# EAGLE design Audio Alarm Monitoring Pi Hat (EAGLE 7.7.0)
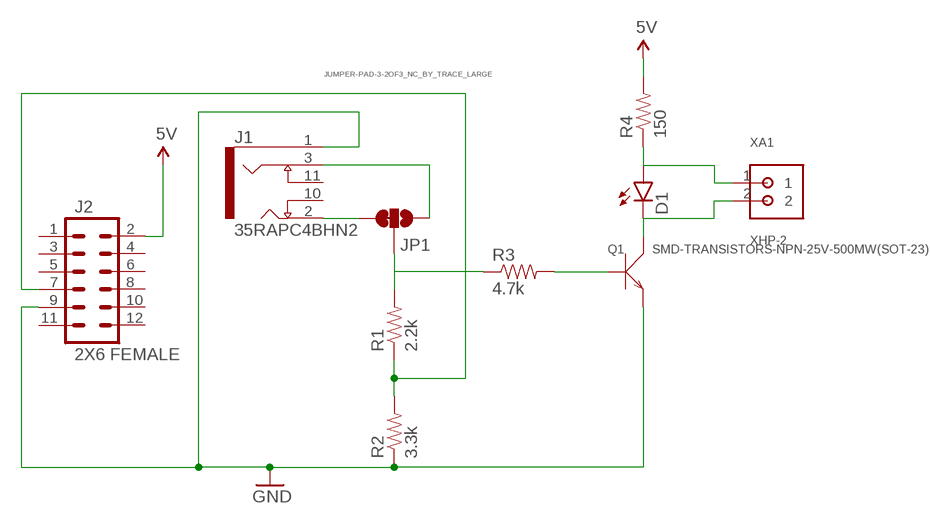
[diagram p0: schematic, sheet 1]

## Parts
D1  LED1206  [LED-1206]
J1  35RAPC4BHN2  [SWITCHCRAFT_35RAPC4BHN2]
J2  2X6 FEMALE  M06X2PTH_FEMALE  [2X6]
JP1  JUMPER-PAD-3-2OF3_NC_BY_TRACE_LARGE  [PAD-JUMPER-3-2OF3_NC_BY_TRACE_YES_SILK_LARGE]
Q1  SMD-TRANSISTORS-NPN-25V-500MW(SOT-23)  [SOT-23]
R1  2.2k  RESISTOR1206  [1206]
R2  3.3k  RESISTOR1206  [1206]
R3  4.7k  RESISTOR1206  [1206]
R4  150  RESISTOR1206  [1206]
XA1  XHP-2  [JST_XHP-2]

## Nets
5V: J2.2 R4.2
GND: J1.1 J2.9 Q1.2(E) R2.1
N$1: J2.7 R1.1 R2.2
N$2: JP1.2 R1.2 R3.1
N$4: J1.2 JP1.3
N$5: D1.C Q1.3(C) XA1.2
N$6: J1.3 JP1.1
N$8: D1.A R4.1 XA1.1
N$9: Q1.1(B) R3.2
Unconnected: J1.10 J1.11 J2.1 J2.3 J2.4 J2.5 J2.6 J2.8 J2.10 J2.11 J2.12

## Library data of the parts
D1 = SparkFun-LED:LED: LEDs Standard schematic elements and footprints for 5mm, 3mm, 1206, and 0603 sized LEDs. 5mm - Spark Fun Electronics SKU : COM-00529 (and others)
J1 = 35RAPC4BHN2:35RAPC4BHN2: Conn 3.5MM Stereo Jack F 5 POS Solder RA Thru-Hole 5 Terminal 1 Port; AVAILABILITY: Unavailable; DESCRIPTION: 3.50mm _0.141, 1/8, Mini Plug_ - Headphone Phone Jack Stereo _3 Conductor, TRS_ Connector Solder; MF: Switchcraft; MP: 35RAPC4BHN2; PACKAGE: None; PRICE: None
J2 = SparkFun-Connectors:M06X2; PROD_ID: CONN-12423
JP1 = SparkFun-Passives:JUMPER-PAD-3-2OF3_NC_BY_TRACE
Q1 = SMD-TRANSISTORS-NPN-25V-500MW_SOT-23_:SMD-TRANSISTORS-NPN-25V-500MW(SOT-23): 305010017; AVAILABILITY: Unavailable; DESCRIPTION: Bipolar _BJT_ Transistor NPN 25V 1.5A 100MHz 625mW Surface Mount SOT-23; MF: Recom Power; MP: S8050; PACKAGE: SOT-23 Micro Commercial; PRICE: None
R1-R4 = SparkFun-Passives:RESISTOR: Resistor Basic schematic elements and footprints for 0603, 1206, and PTH resistors.
XA1 = XHP-2:XHP-2: XH Series 2 Position 2.5 mm Pitch Wire-to-Board Housing Connector; AVAILABILITY: Unavailable; DESCRIPTION: 20 Rectangular Connectors - Housings Receptacle Natural 0.098 _2.50mm_; MF: JST Sales; MP: XHP-2; PACKAGE: None; PRICE: None

## Board
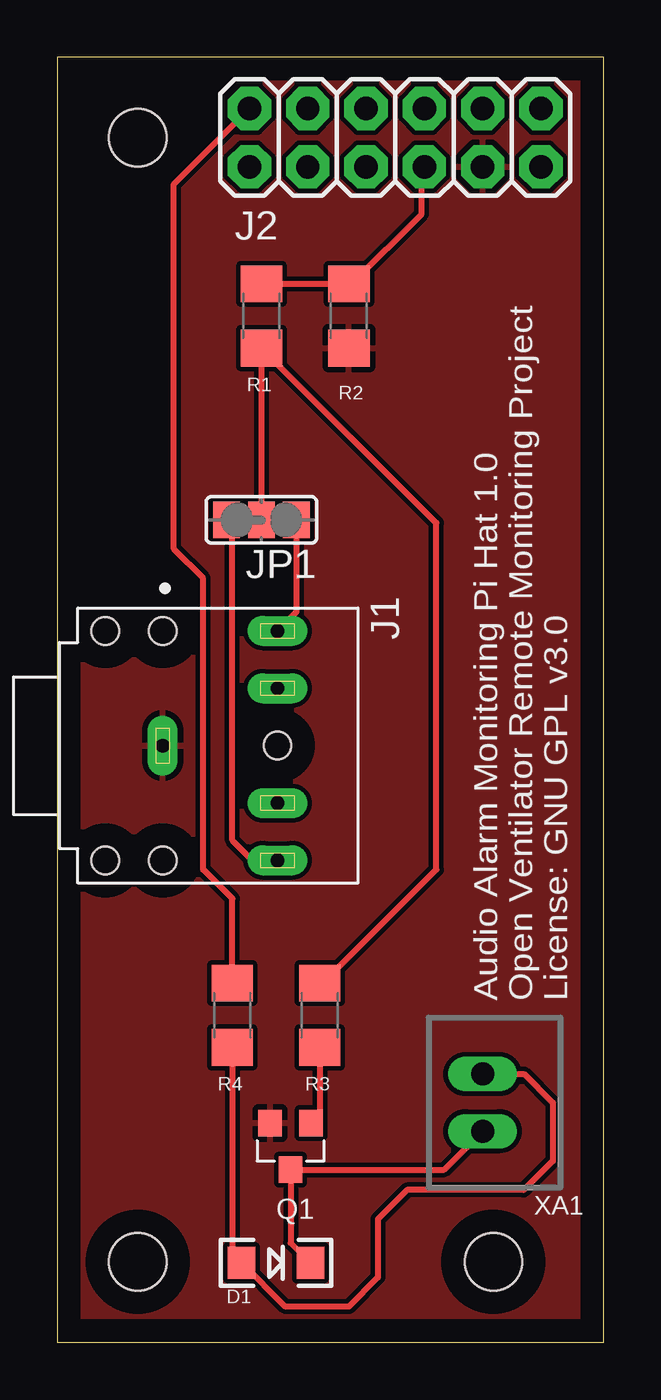
[diagram p1: board, top side]
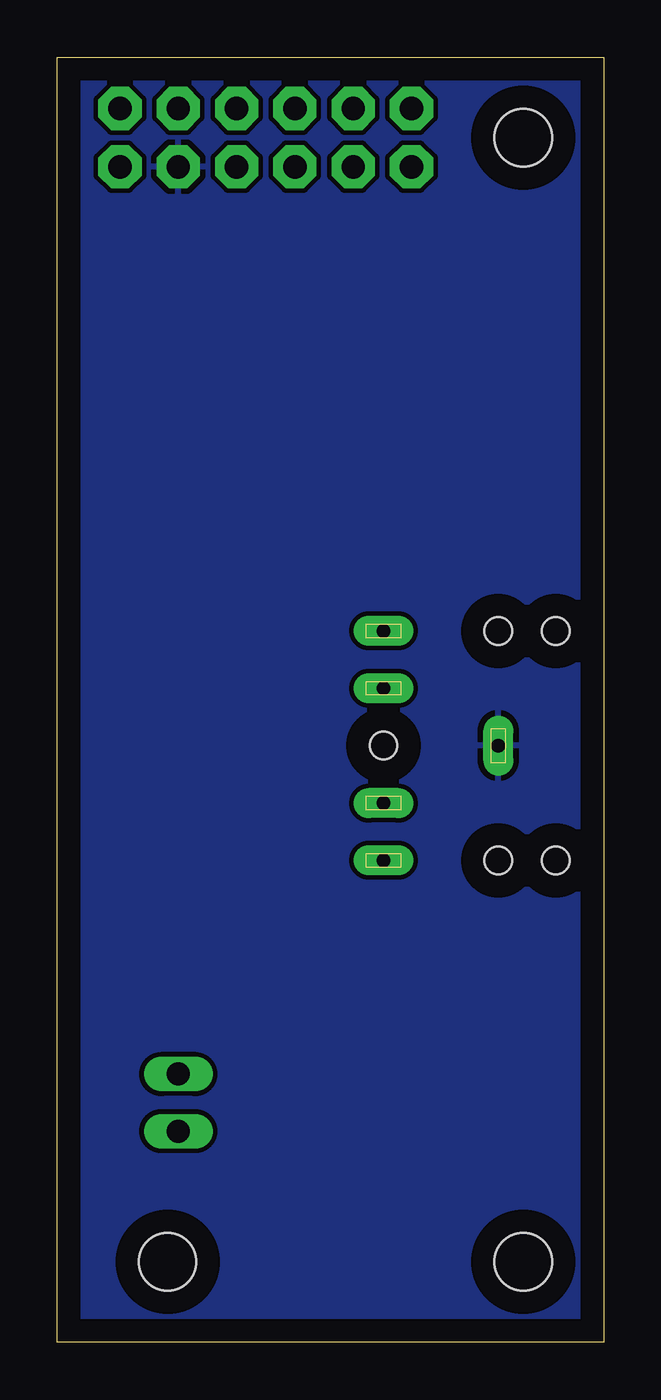
[diagram p2: board, bottom side, seen from below]

Size 23.8 x 56 mm. Coordinates in mm from the lower left corner, seen from the top.
Outline: 0,0 23.8,0 23.8,56 0,56 0,0
Copper layers (1*16): Top 0.035mm / dielectric 1.5mm / Bottom 0.035mm
Design rules "default *": minimum track width 7mil, minimum drill 10mil, track to track 8mil, track to pad 8mil, pad to pad 8mil, via to via 8mil, smd to smd 8mil, copper to edge 40mil, drill to drill 8mil, minimum pad ring 10mil, minimum via ring 8mil, stop-mask expansion 4mil, vias tented up to drill 0mil, thermal gap 10mil
Holes 2.5 mm at 3.5,52.5 3.5,3.5 19,3.5

### Footprints (pad centres in the part's own frame; a part is rotated, then mirrored left to right if it is on the bottom)
LED-1206 = smd 1.2 x 1.4: A -1.5,0; C 1.5,0
SWITCHCRAFT_35RAPC4BHN2 = drill 0.6 pad 1.3 long: 1 0,-1; 2 5,4; 3 -5,4; 10 2.5,4; 11 -2.5,4 | hole 1.2: 0,4; -5,-1; -5,-3.5; 5,-1; 5,-3.5
2X6 = drill 1.016 pad 1.88 octagon: 1 0,0; 2 0,2.54; 3 2.54,0; 4 2.54,2.54; 5 5.08,0; 6 5.08,2.54; 7 7.62,0; 8 7.62,2.54; 9 10.16,0; 10 10.16,2.54; 11 12.7,0; 12 12.7,2.54
PAD-JUMPER-3-2OF3_NC_BY_TRACE_YES_SILK_LARGE = smd 1.168 x 1.6: 1 -1.524,0; 2 0,0; 3 1.524,0
SOT-23 = smd 1.016 x 1.143: 1 -0.889,-1.016; 2 0.889,-1.016; 3 0,1.016
1206 = smd 1.6 x 1.8: 1 -1.4,0; 2 1.4,0
JST_XHP-2 = drill 1 long: 1 -1.25,-0.525; 2 1.25,-0.525

### Placement (x,y rotation side)
D1  9.53,3.45 0 top
J1  5.59,26 270 top
J2  8.37,51.23 0 top
JP1  8.89,35.84 180 top
Q1  10.16,8.54 180 top
R1  8.89,44.73 270 top
R2  12.7,44.73 90 top
R3  11.43,14.25 270 top
R4  7.62,14.25 90 top
XA1  19.05,10.44 270 top

### Tracks (layer width: path | path; a pad name or v marks a point on that pad's centre or on a via)
5V
  Top 0.254: R4.2 7.62,19.33 6.35,20.6 6.35,33.3 5.08,34.57 5.08,50.48 J2.2
GND
  pour Bottom: -2.54,59.97 26.67,59.97 26.67,-2.26 -2.54,-2.26
  pour Top: -1.27,58.7 -1.27,-0.99 25.4,-0.99 25.4,58.7
N$1
  Top 0.254: J2.7 15.88,51.11 15.88,49.17 12.83,46.13 R2.2 R1.1
N$2
  Top 0.254: R3.1 11.56,15.65 16.51,20.6 16.51,35.71 R1.2 JP1.2
N$4
  Top 0.254: J1.2 8.49,21 7.62,21.87 7.62,35.59 JP1.3
N$5
  Top 0.254: D1.C 10.16,4.32 Q1.3 16.85,7.52 XA1.2
N$6
  Top 0.254: JP1.1 10.41,31.83 J1.3
N$8
  Top 0.254: R4.1 7.62,3.86 D1.A 9.93,1.55 12.7,1.55 13.97,2.82 13.97,5.36 15.24,6.63 20.32,6.63 21.59,7.9 21.59,10.44 20.34,11.69 XA1.1
N$9
  Top 0.254: R3.2 11.43,9.17 Q1.1

### Text on the board
tNames: Audio Alarm Monitoring Pi Hat 1.0 / Open Ventilator Remote Monitoring Project / License: GNU GPL v3.0
tValues: SS8050